# Altium schematic sheet Sheet1.SchDoc
size Letter
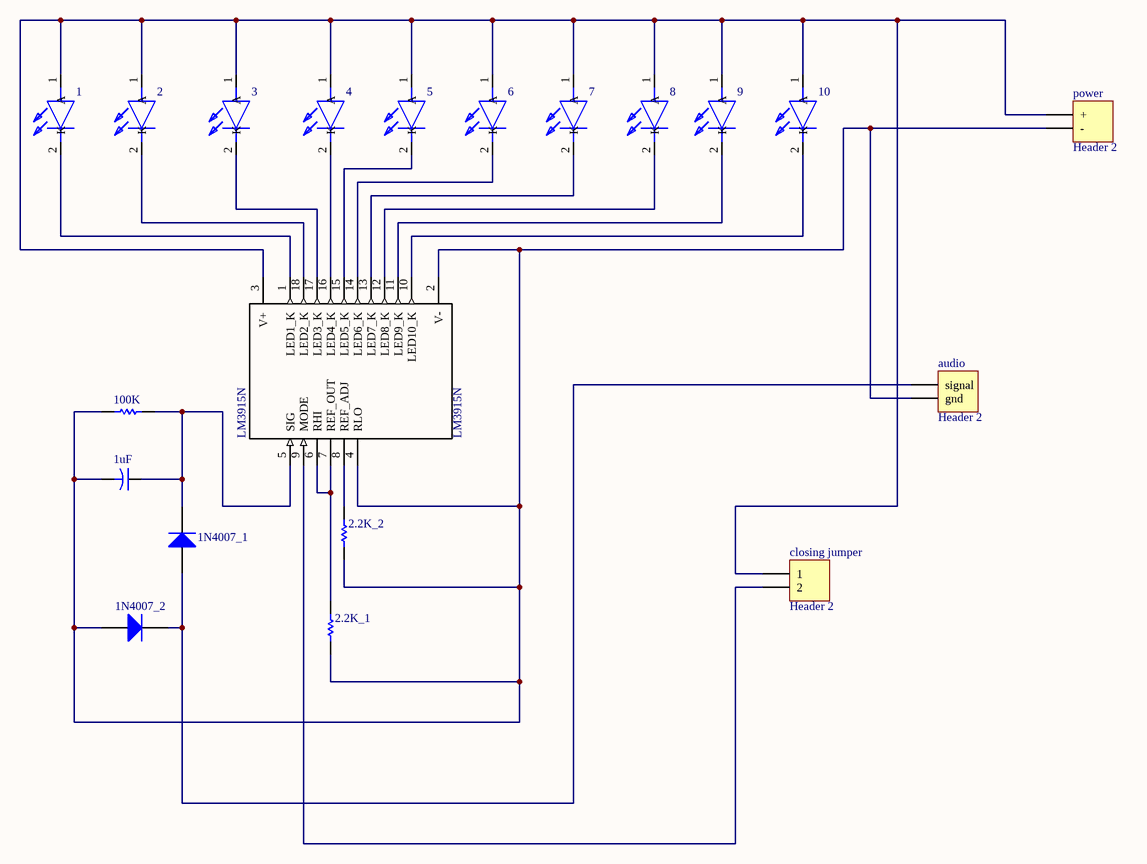
[diagram p0: Sheet1.SchDoc]

## Parts
1  L-53GD  [L-53GD]  (value not drawn)
1N4007_1  1N4007  [DO-41]  (value not drawn)
1N4007_2  Diode 1N4007  [DO-41]  (value not drawn)
1uF  Cap2  [CAPR5-4X5]  (value not drawn)
2  L-53GD  [L-53GD]  (value not drawn)
2.2K_1  Res1  [AXIAL-0.3]  (value not drawn)
2.2K_2  Res1  [AXIAL-0.3]  (value not drawn)
3  L-53GD  [L-53GD]  (value not drawn)
4  L-53GD  [L-53GD]  (value not drawn)
5  L-53GD  [L-53GD]  (value not drawn)
6  L-53GD  [L-53GD]  (value not drawn)
7  L-53GD  [L-53GD]  (value not drawn)
8  L-53GD  [L-53GD]  (value not drawn)
9  L-53GD  [L-53GD]  (value not drawn)
10  L-53GD  [L-53GD]  (value not drawn)
100K  Res1  [AXIAL-0.3]  (value not drawn)
audio  Header 2  [HDR1X2]
closing_jumper  Header 2  [HDR1X2]
LM3915N  LM3915N  [*DIP795W25P254L2337H533Q18B]
power  Header 2  [HDR1X2]

## Nets
Net1_1: 1.1(A) 2.1(A) 3.1(A) 4.1(A) 5.1(A) 6.1(A) 7.1(A) 8.1(A) 9.1(A) 10.1(A) closing_jumper.1 LM3915N.3(V+) power.1(+)
Net1_2: 1.2(K) LM3915N.1(LED1_K)
Net1N4007_1_1: 1N4007_1.1(A) 1N4007_2.2(K) audio.1(signal)
Net1N4007_1_2: 1N4007_1.2(K) 1uF.1 100K.2 LM3915N.5(SIG)
Net1N4007_2_1: 1N4007_2.1(A) 1uF.2 2.2K_1.1 2.2K_2.1 100K.1 audio.2(gnd) LM3915N.2(V-) LM3915N.4(RLO) power.2(-)
Net2.2K_1_2: 2.2K_1.2 LM3915N.6(RHI) LM3915N.7(REF_OUT)
Net2.2K_2_2: 2.2K_2.2 LM3915N.8(REF_ADJ)
Net2_2: 2.2(K) LM3915N.18(LED2_K)
Net3_2: 3.2(K) LM3915N.17(LED3_K)
Net4_2: 4.2(K) LM3915N.16(LED4_K)
Net5_2: 5.2(K) LM3915N.15(LED5_K)
Net6_2: 6.2(K) LM3915N.14(LED6_K)
Net7_2: 7.2(K) LM3915N.13(LED7_K)
Net8_2: 8.2(K) LM3915N.12(LED8_K)
Net9_2: 9.2(K) LM3915N.11(LED9_K)
Net10_2: 10.2(K) LM3915N.10(LED10_K)
Netclosing_jumper_2: closing_jumper.2 LM3915N.9(MODE)

## Library data of the parts
1-10 = L-53GD: LED; Manufacturer_Name: Kingbright; Allied_Number: 70424261; Datasheet Link: http://docs-emea.rs-online.com/webdocs/151e/0900766b8151e408.pdf; Manufacturer_Part_Number: L-53GD; Mouser Part Number: N/A; Mouser Price/Stock: https://www.mouser.com/Search/Refine.aspx?Keyword=N%2FA; RS Part Number: 2286004A; RS Price/Stock: http://uk.rs-online.com/web/p/products/2286004A; Allied Price/Stock: http://www.alliedelec.com/kingbright-l-53gd/70424261/
1N4007_1 1N4007_2 = Diode 1N4007: 1 Amp General Purpose Rectifier; Published: 8-Jun-2000; LatestRevisionDate: 17-Jul-2002; LatestRevisionNote: Re-released for DXP Platform.; DatasheetVersion: 1998; PackageVersion: Aug-1999; PackageReference: DO-41; Publisher: Altium Limited; PackageDescription: Diode, Axial; Body 5.2 x 2.7 mm (LxDia. max), Lead Dia. 0.86 mm (max); Code_JEDEC: DO-204-AL; ComponentLink1Description: Manufacturer Link; ComponentLink1URL: http://www.fairchildsemi.com/; ComponentLink2Description: Datasheet; ComponentLink2URL: http://www.fairchildsemi.com/ds/1N%2F1N4001.pdf
1uF = Cap2: Capacitor; Value: 100pF; Published: 23-Sep-2002; PackageReference: CAPR5-4X5; Publisher: Altium Limited; PackageDescription: Capacitor; 2 Leads
2.2K_1 2.2K_2 100K = Res1: Resistor; Value: 1K; Published: 8-Jun-2000; LatestRevisionDate: 17-Jul-2002; LatestRevisionNote: Re-released for DXP Platform.; PackageReference: AXIAL-0.3; Publisher: Altium Limited; PackageDescription: Axial Device, Thru-Hole; 2 Leads; 0.3 in Pin Spacing
audio closing_jumper power = Header 2: Header, 2-Pin; LatestRevisionDate: 17-Jul-2002; LatestRevisionNote: Re-released for DXP Platform.; Publisher: Altium Limited
LM3915N = LM3915N-1: LED DRVR 10Segment 3.3V/5V/9V/12V/15V/18V/24V 18-Pin PDIP Tube; MF: Texas Instruments; SnapEDA_Link: https://www.snapeda.com/parts/LM3915N-1/Texas%20Instruments/view-part/?ref=snap; Availability: Unavailable; Package: DIP-18 Texas Instruments; Price: None; MP: LM3915N-1; Value: *